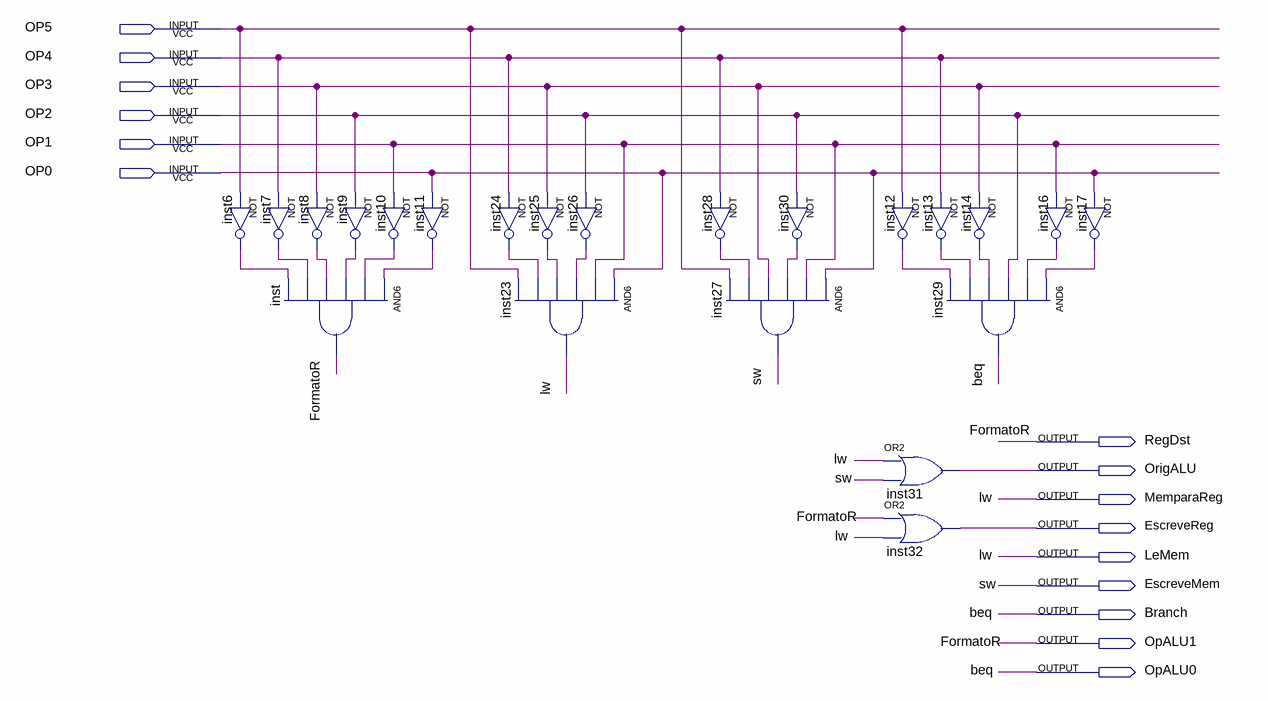
[diagram p0: schematic sheet]
// Quartus schematic Controle.bdf as structural Verilog: 22 symbols, 15 pins
module Controle (
  input  OP5,
  input  OP4,
  input  OP3,
  input  OP2,
  input  OP1,
  input  OP0,
  output RegDst,
  output OrigALU,
  output MemparaReg,
  output EscreveReg,
  output LeMem,
  output EscreveMem,
  output Branch,
  output OpALU1,
  output OpALU0
);

  wire inst6_out, inst7_out, inst8_out, inst9_out, inst10_out, inst11_out, inst12_out, inst13_out,
       inst14_out, inst16_out, inst17_out, inst24_out, inst25_out, inst26_out, inst28_out, inst30_out;

  not inst6 (inst6_out, OP5);
  not inst7 (inst7_out, OP4);
  not inst8 (inst8_out, OP3);
  and inst (OpALU1, inst11_out, inst10_out, inst9_out, inst8_out, inst7_out, inst6_out);
  not inst9 (inst9_out, OP2);
  not inst10 (inst10_out, OP1);
  not inst11 (inst11_out, OP0);
  not inst24 (inst24_out, OP4);
  not inst25 (inst25_out, OP3);
  and inst23 (LeMem, OP0, OP1, inst26_out, inst25_out, inst24_out, OP5);
  not inst26 (inst26_out, OP2);
  not inst28 (inst28_out, OP4);
  and inst27 (EscreveMem, OP0, OP1, inst30_out, OP3, inst28_out, OP5);
  not inst30 (inst30_out, OP2);
  not inst12 (inst12_out, OP5);
  not inst13 (inst13_out, OP4);
  and inst29 (Branch, inst17_out, inst16_out, OP2, inst14_out, inst13_out, inst12_out);
  or inst31 (OrigALU, LeMem, EscreveMem);
  or inst32 (EscreveReg, OpALU1, LeMem);
  not inst14 (inst14_out, OP3);
  not inst16 (inst16_out, OP1);
  not inst17 (inst17_out, OP0);

  assign MemparaReg = LeMem;
  assign OpALU0 = Branch;
  assign RegDst = OpALU1;

  // Other names for the same wires on the sheet: beq = Branch; FormatoR = OpALU1; lw = LeMem; sw = EscreveMem
endmodule
